# Altium schematic sheet FPGA - XC6SLX45T-2CSG324C.schdoc
size D
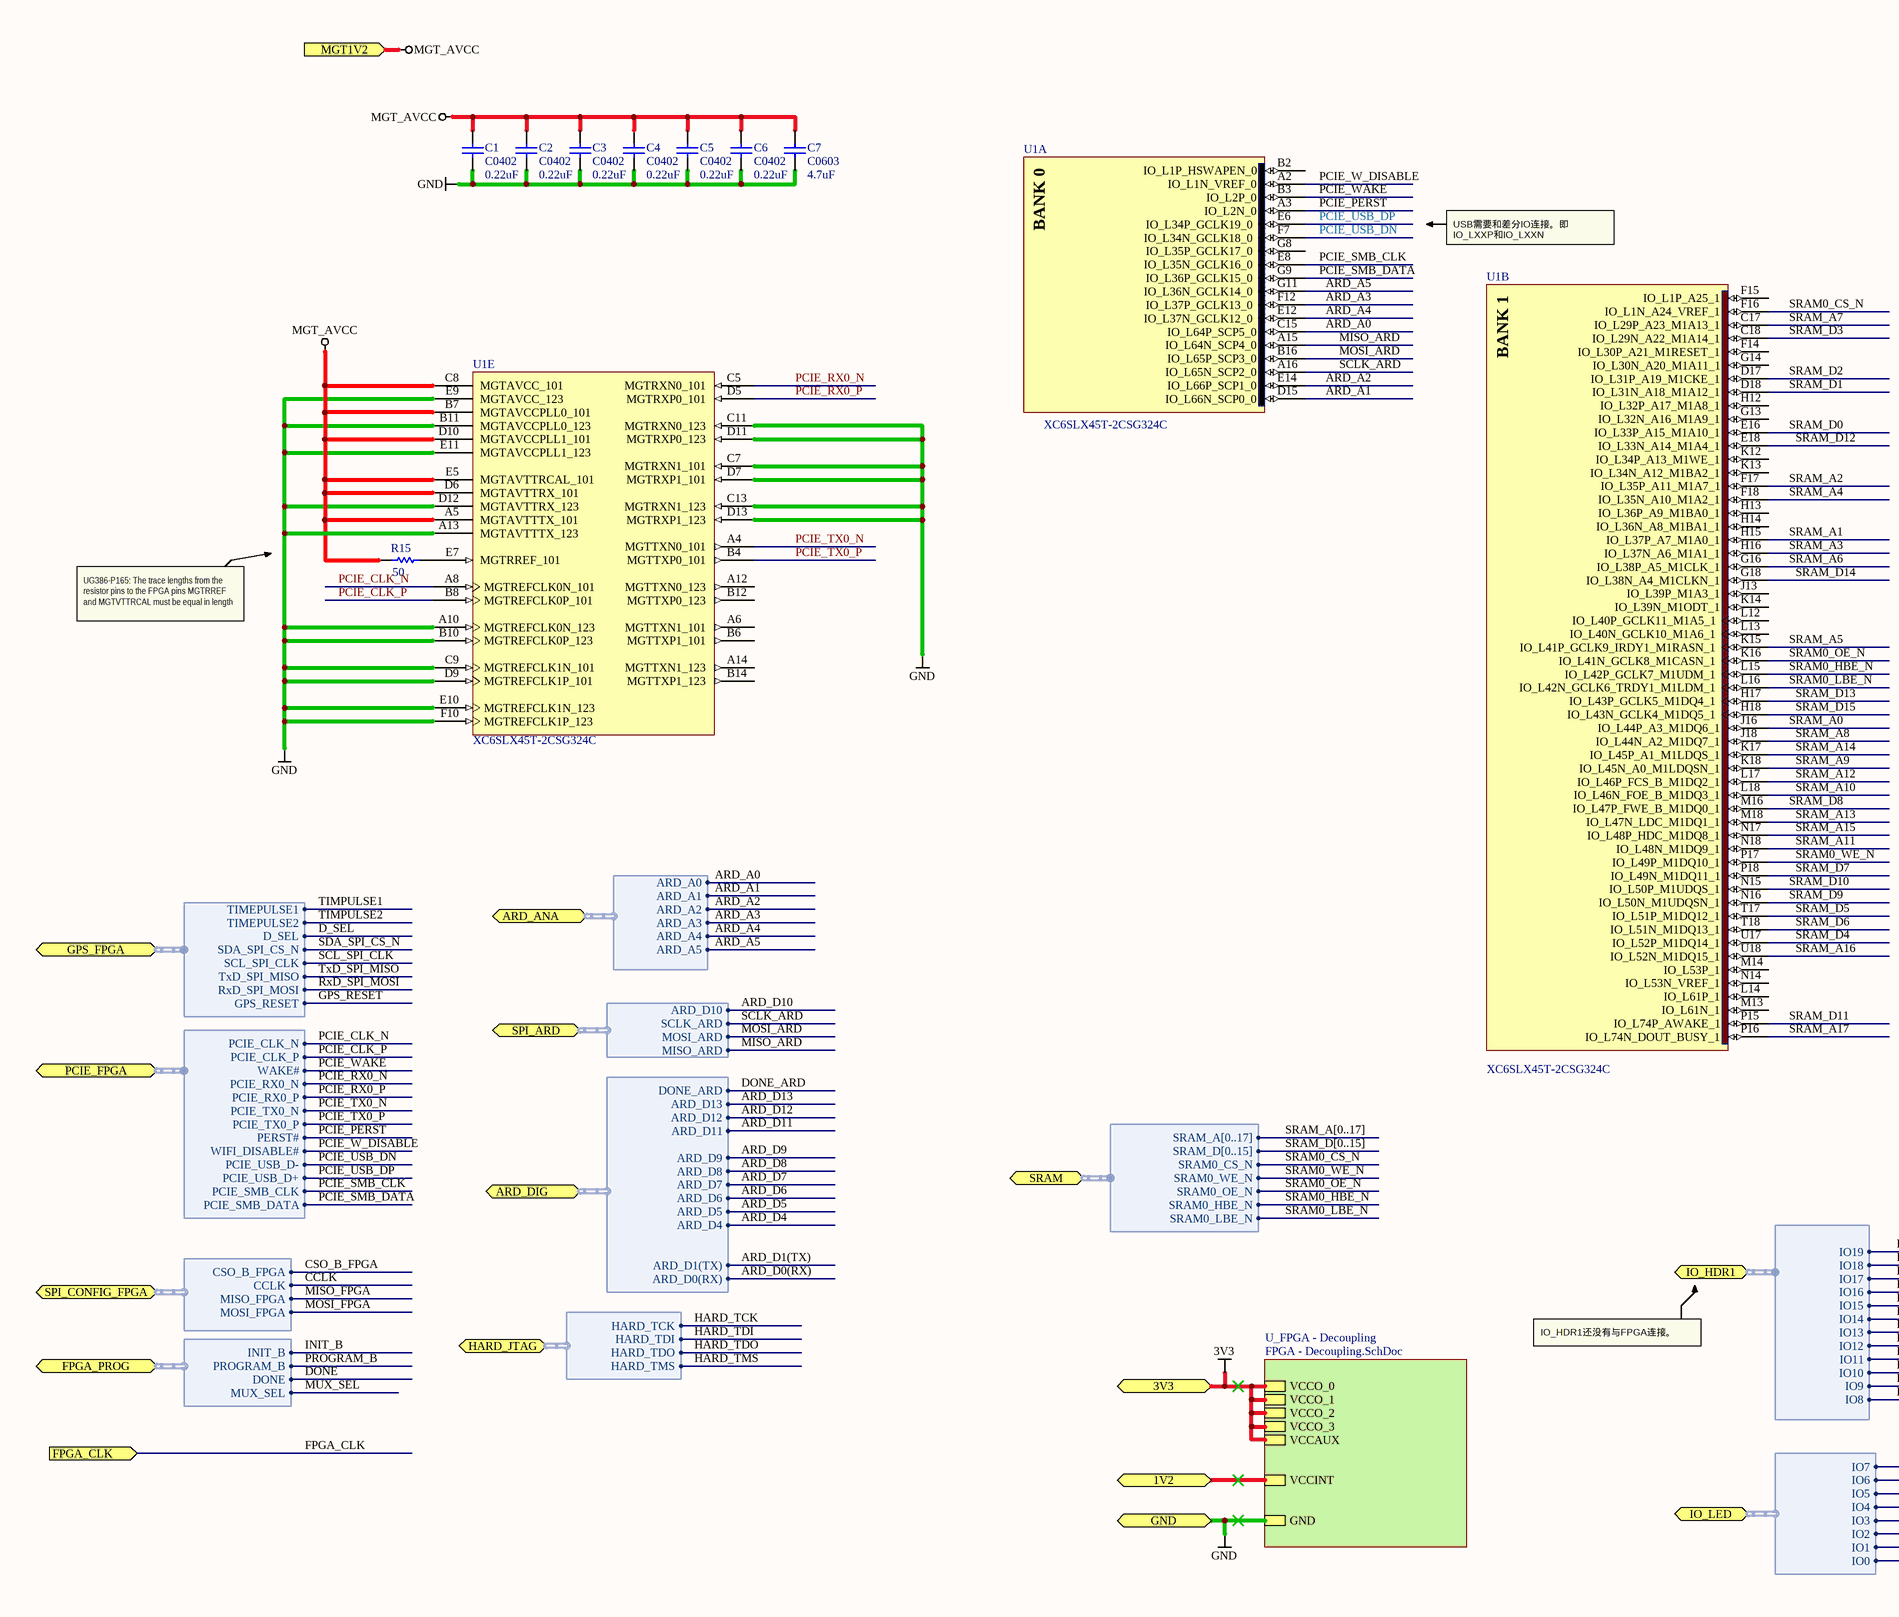
[diagram p0: FPGA - XC6SLX45T-2CSG324C.schdoc, left]
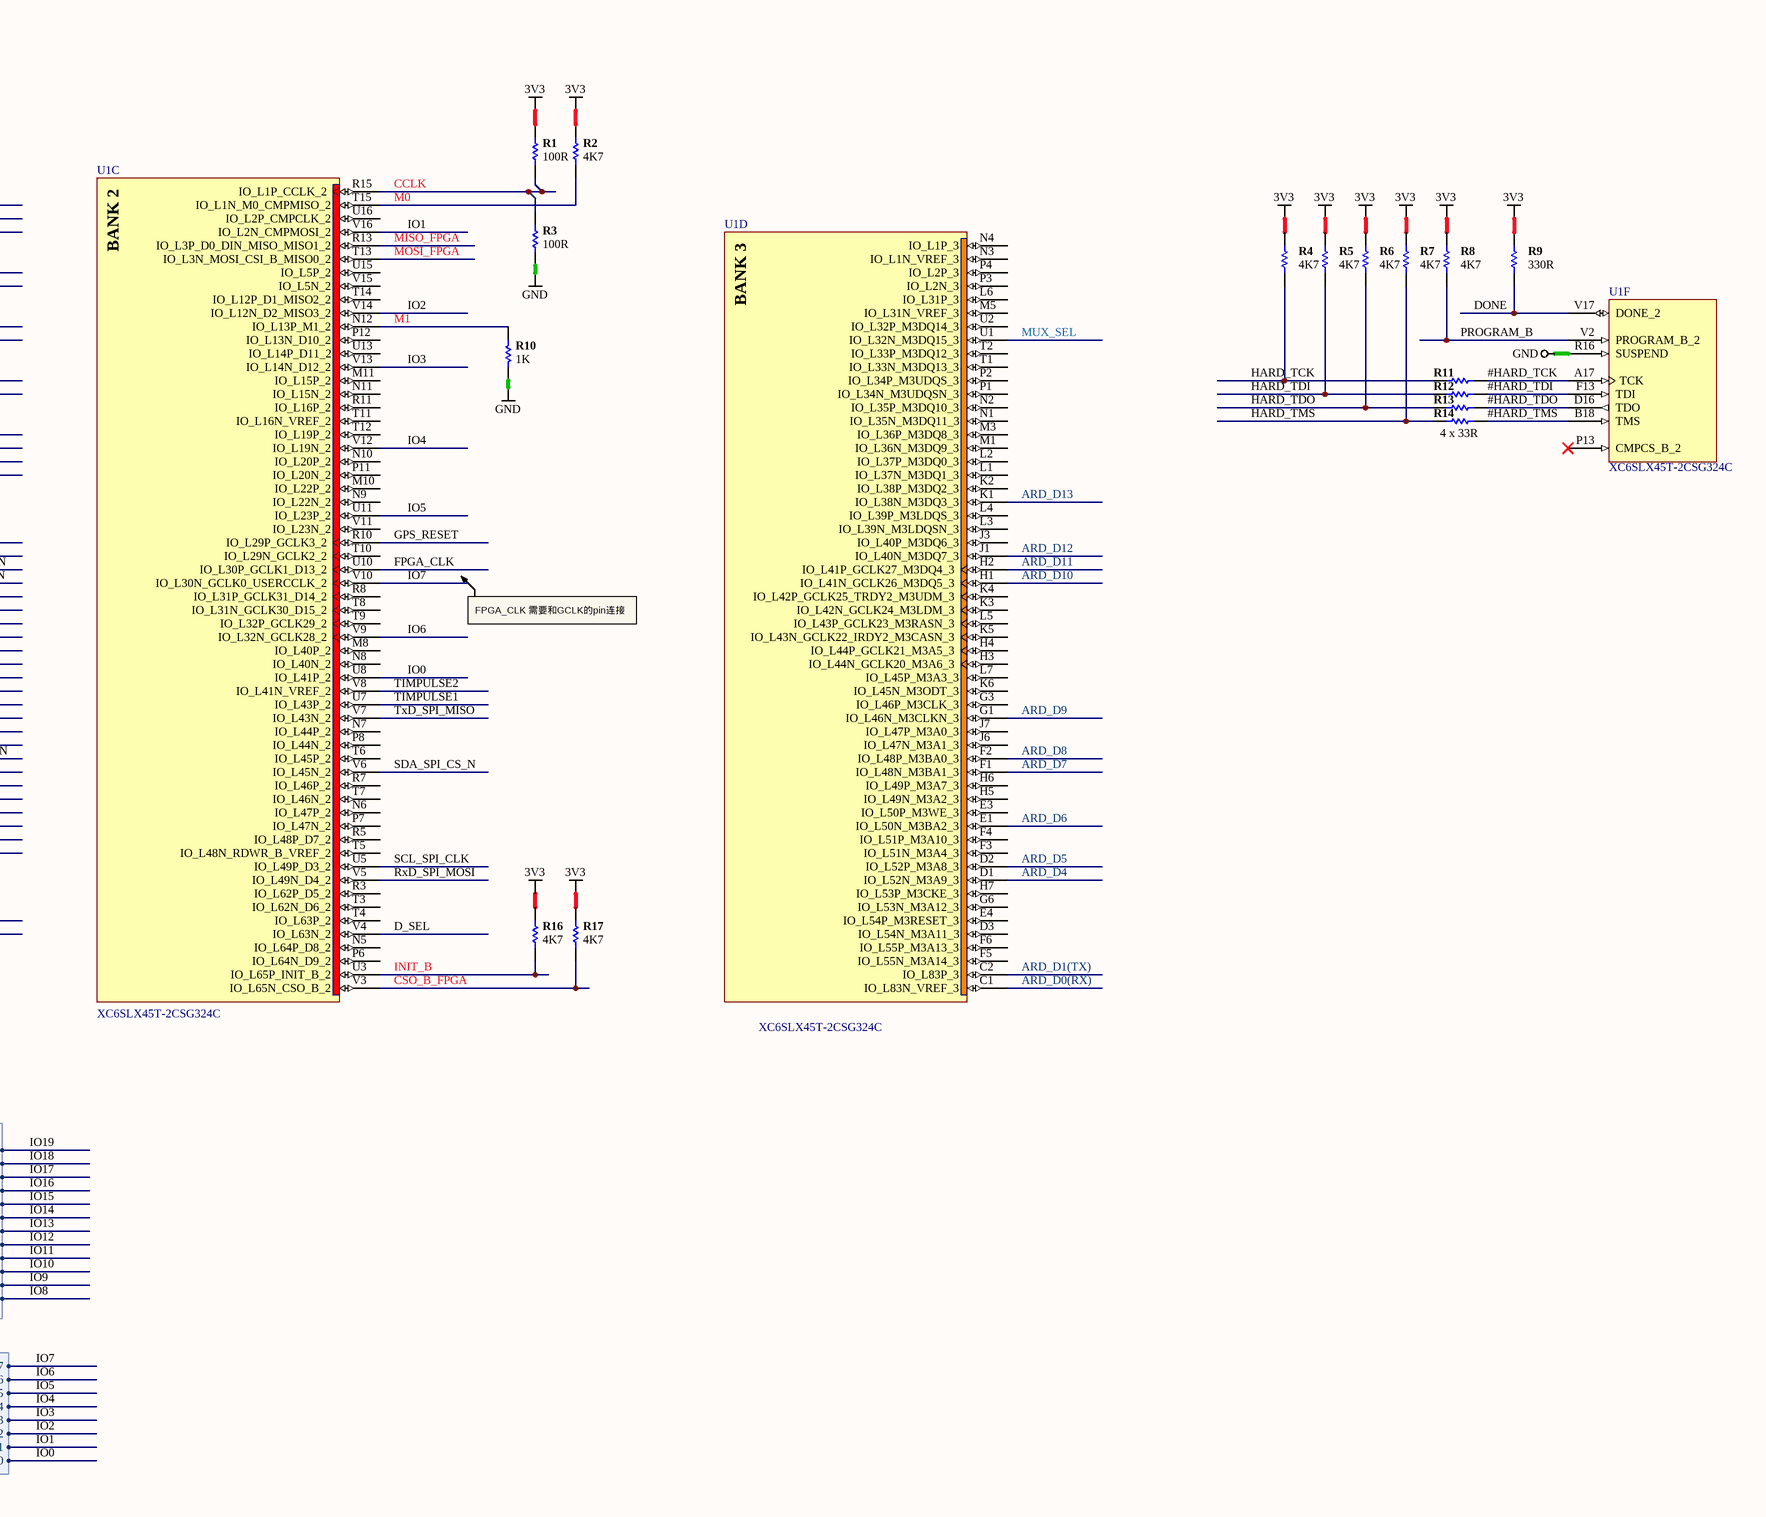
[diagram p1: FPGA - XC6SLX45T-2CSG324C.schdoc, right]

## Parts
C1  C0402  value 0.22uF  [CAPC0402(1005)60_L]
C2  C0402  value 0.22uF  [CAPC0402(1005)60_L]
C3  C0402  value 0.22uF  [CAPC0402(1005)60_L]
C4  C0402  value 0.22uF  [CAPC0402(1005)60_L]
C5  C0402  value 0.22uF  [CAPC0402(1005)60_L]
C6  C0402  value 0.22uF  [CAPC0402(1005)60_L]
C7  C0603  value 4.7uF  [CAPC0603(1608)55_L]
R1  value 100R  [RESC0402(1005)40_L]  (hidden comment: 100R 1 0402)
R2  value 4K7  [RESC0402(1005)40_L]  (hidden comment: 4K7 1 0402)
R3  value 100R  [RESC0402(1005)40_L]  (hidden comment: 100R 1 0402)
R4  value 4K7  [RESC0402(1005)40_L]  (hidden comment: 4K7 1 0402)
R5  value 4K7  [RESC0402(1005)40_L]  (hidden comment: 4K7 1 0402)
R6  value 4K7  [RESC0402(1005)40_L]  (hidden comment: 4K7 1 0402)
R7  value 4K7  [RESC0402(1005)40_L]  (hidden comment: 4K7 1 0402)
R8  value 4K7  [RESC0402(1005)40_L]  (hidden comment: 4K7 1 0402)
R9  value 330R  [RESC0402(1005)40_L]  (hidden comment: 330R 1 0402)
R10  value 1K  [RESC0402(1005)40_L]  (hidden comment: 1K 1 0402)
R11  33R 1 0402  [RESC0402(1005)40_L]  (value not drawn)
R12  33R 1 0402  [RESC0402(1005)40_L]  (value not drawn)
R13  33R 1 0402  [RESC0402(1005)40_L]  (value not drawn)
R14  33R 1 0402  [RESC0402(1005)40_L]  (value not drawn)
R15  value 50  [RESC0402(1005)40_L]  (hidden comment: Res1)
R16  value 4K7  [RESC0402(1005)40_L]  (hidden comment: 4K7 1 0402)
R17  value 4K7  [RESC0402(1005)40_L]  (hidden comment: 4K7 1 0402)
U1  XC6SLX45T-2CSG324C  [CSG324]  (parts A,B,C,D,E,F of 8)

## Sub-sheets
U_FPGA - Decoupling = FPGA - Decoupling.SchDoc: VCCO_0, VCCO_3, VCCO_1, VCCO_2, VCCAUX, VCCINT, GND

## Ports
1V2, 3V3, ARD_ANA (harness ARD_ANA), ARD_DIG (harness ARD_DIG), FPGA_CLK (in), FPGA_PROG (harness FPGA_PROGRAM), GND, GPS_FPGA (harness GPS_FPGA), HARD_JTAG (harness HARD_JTAG), IO_HDR1 (harness IO_HDR1), IO_LED (harness IO_LED), MGT1V2 (in), PCIE_FPGA (harness PCIE_FPGA), SPI_ARD (harness SPI_ARD), SPI_CONFIG_FPGA (harness SPI_CONFIG_FPGA), SRAM (harness SRAM)

## Harnesses
SPI_CONFIG_FPGA: CSO_B_FPGA, CCLK, MISO_FPGA, MOSI_FPGA
HARD_JTAG: HARD_TCK, HARD_TDI, HARD_TDO, HARD_TMS
FPGA_PROGRAM: INIT_B, PROGRAM_B, DONE, MUX_SEL
SRAM: SRAM_A[0..17], SRAM_D[0..15], SRAM0_CS_N, SRAM0_WE_N, SRAM0_OE_N, SRAM0_HBE_N, SRAM0_LBE_N
SPI_ARD: MISO_ARD, MOSI_ARD, SCLK_ARD, ARD_D10
ARD_DIG: ARD_D0(RX), ARD_D1(TX), ARD_D4, ARD_D5, ARD_D6, ARD_D7, ARD_D8, ARD_D9, ARD_D11, ARD_D12, ARD_D13, DONE_ARD
ARD_ANA: ARD_A0, ARD_A1, ARD_A2, ARD_A3, ARD_A4, ARD_A5
GPS_FPGA: TIMEPULSE1, TIMEPULSE2, SDA_SPI_CS_N, SCL_SPI_CLK, TxD_SPI_MISO, RxD_SPI_MOSI, D_SEL, GPS_RESET
IO_LED: IO0, IO1, IO2, IO3, IO4, IO5, IO6, IO7
IO_HDR1: IO12, IO13, IO16, IO17, IO18, IO19, IO14, IO15, IO8, IO9, IO10, IO11
PCIE_FPGA: PCIE_CLK_N, PCIE_CLK_P, PCIE_RX0_N, PCIE_RX0_P, PCIE_TX0_N, PCIE_TX0_P, PERST#, WIFI_DISABLE#, PCIE_USB_D-, PCIE_USB_D+, PCIE_SMB_CLK, PCIE_SMB_DATA, WAKE#

## Nets
3V3: R1.2 R2.2 R4.2 R5.2 R6.2 R7.2 R8.2 R9.2 R16.2 R17.2 ; port 3V3, sheet U_FPGA - Decoupling/VCCO_0, sheet U_FPGA - Decoupling/VCCO_3, sheet U_FPGA - Decoupling/VCCO_1, sheet U_FPGA - Decoupling/VCCO_2, sheet U_FPGA - Decoupling/VCCAUX
GND: C1.1 C2.1 C3.1 C4.1 C5.1 C6.1 C7.1 R3.1 R10.1 U1.A10(MGTREFCLK0N_123) U1.A13(MGTAVTTTX_123) U1.B10(MGTREFCLK0P_123) U1.B11(MGTAVCCPLL0_123) U1.C7(MGTRXN1_101) U1.C9(MGTREFCLK1N_101) U1.C11(MGTRXN0_123) U1.C13(MGTRXN1_123) U1.D7(MGTRXP1_101) U1.D9(MGTREFCLK1P_101) U1.D11(MGTRXP0_123) U1.D12(MGTAVTTRX_123) U1.D13(MGTRXP1_123) U1.E9(MGTAVCC_123) U1.E10(MGTREFCLK1N_123) U1.E11(MGTAVCCPLL1_123) U1.F10(MGTREFCLK1P_123) U1.R16(SUSPEND) ; port GND, sheet U_FPGA - Decoupling/GND
MGT_AVCC: C1.2 C2.2 C3.2 C4.2 C5.2 C6.2 C7.2 R15.1 U1.A5(MGTAVTTTX_101) U1.B7(MGTAVCCPLL0_101) U1.C8(MGTAVCC_101) U1.D6(MGTAVTTRX_101) U1.D10(MGTAVCCPLL1_101) U1.E5(MGTAVTTRCAL_101) ; port MGT1V2
1V2: port 1V2, sheet U_FPGA - Decoupling/VCCINT
#HARD_TCK: R11.2 U1.A17(TCK)
#HARD_TDI: R12.2 U1.F13(TDI)
#HARD_TDO: R13.2 U1.D16(TDO)
#HARD_TMS: R14.2 U1.B18(TMS)
ARD_A0: U1.C15(IO_L64P_SCP5_0) ; port ARD_ANA.ARD_A0
ARD_A1: U1.D15(IO_L66N_SCP0_0) ; port ARD_ANA.ARD_A1
ARD_A2: U1.E14(IO_L66P_SCP1_0) ; port ARD_ANA.ARD_A2
ARD_A3: U1.F12(IO_L37P_GCLK13_0) ; port ARD_ANA.ARD_A3
ARD_A4: U1.E12(IO_L37N_GCLK12_0) ; port ARD_ANA.ARD_A4
ARD_A5: U1.G11(IO_L36N_GCLK14_0) ; port ARD_ANA.ARD_A5
ARD_D0(RX): U1.C1(IO_L83N_VREF_3) ; port ARD_DIG.ARD_D0(RX)
ARD_D1(TX): U1.C2(IO_L83P_3) ; port ARD_DIG.ARD_D1(TX)
ARD_D4: U1.D1(IO_L52N_M3A9_3) ; port ARD_DIG.ARD_D4
ARD_D5: U1.D2(IO_L52P_M3A8_3) ; port ARD_DIG.ARD_D5
ARD_D6: U1.E1(IO_L50N_M3BA2_3) ; port ARD_DIG.ARD_D6
ARD_D7: U1.F1(IO_L48N_M3BA1_3) ; port ARD_DIG.ARD_D7
ARD_D8: U1.F2(IO_L48P_M3BA0_3) ; port ARD_DIG.ARD_D8
ARD_D9: U1.G1(IO_L46N_M3CLKN_3) ; port ARD_DIG.ARD_D9
ARD_D10: U1.H1(IO_L41N_GCLK26_M3DQ5_3) ; port SPI_ARD.ARD_D10
ARD_D11: U1.H2(IO_L41P_GCLK27_M3DQ4_3) ; port ARD_DIG.ARD_D11
ARD_D12: U1.J1(IO_L40N_M3DQ7_3) ; port ARD_DIG.ARD_D12
ARD_D13: U1.K1(IO_L38N_M3DQ3_3) ; port ARD_DIG.ARD_D13
CCLK: R1.1 R3.2 U1.R15(IO_L1P_CCLK_2) ; port SPI_CONFIG_FPGA.CCLK
CSO_B_FPGA: R17.1 U1.V3(IO_L65N_CSO_B_2) ; port SPI_CONFIG_FPGA.CSO_B_FPGA
D_SEL: U1.V4(IO_L63N_2) ; port GPS_FPGA.D_SEL
DONE: R9.1 U1.V17(DONE_2) ; port FPGA_PROG.DONE
DONE_ARD: port ARD_DIG.DONE_ARD
FPGA_CLK: U1.U10(IO_L30P_GCLK1_D13_2) ; port FPGA_CLK
GPS_RESET: U1.R10(IO_L29P_GCLK3_2) ; port GPS_FPGA.GPS_RESET
HARD_TCK: R4.1 R11.1 ; port HARD_JTAG.HARD_TCK
HARD_TDI: R5.1 R12.1 ; port HARD_JTAG.HARD_TDI
HARD_TDO: R6.1 R13.1 ; port HARD_JTAG.HARD_TDO
HARD_TMS: R7.1 R14.1 ; port HARD_JTAG.HARD_TMS
INIT_B: R16.1 U1.U3(IO_L65P_INIT_B_2) ; port FPGA_PROG.INIT_B
IO0: U1.U8(IO_L41P_2) ; port IO_LED.IO0
IO1: U1.V16(IO_L2N_CMPMOSI_2) ; port IO_LED.IO1
IO2: U1.V14(IO_L12N_D2_MISO3_2) ; port IO_LED.IO2
IO3: U1.V13(IO_L14N_D12_2) ; port IO_LED.IO3
IO4: U1.V12(IO_L19N_2) ; port IO_LED.IO4
IO5: U1.U11(IO_L23P_2) ; port IO_LED.IO5
IO6: U1.V9(IO_L32N_GCLK28_2) ; port IO_LED.IO6
IO7: U1.V10(IO_L30N_GCLK0_USERCCLK_2) ; port IO_LED.IO7
IO8: port IO_HDR1.IO8
IO9: port IO_HDR1.IO9
IO10: port IO_HDR1.IO10
IO11: port IO_HDR1.IO11
IO12: port IO_HDR1.IO12
IO13: port IO_HDR1.IO13
IO14: port IO_HDR1.IO14
IO15: port IO_HDR1.IO15
IO16: port IO_HDR1.IO16
IO17: port IO_HDR1.IO17
IO18: port IO_HDR1.IO18
IO19: port IO_HDR1.IO19
M0: R2.1 U1.T15(IO_L1N_M0_CMPMISO_2)
M1: R10.2 U1.N12(IO_L13P_M1_2)
MISO_ARD: U1.A15(IO_L64N_SCP4_0) ; port SPI_ARD.MISO_ARD
MISO_FPGA: U1.R13(IO_L3P_D0_DIN_MISO_MISO1_2) ; port SPI_CONFIG_FPGA.MISO_FPGA
MOSI_ARD: U1.B16(IO_L65P_SCP3_0) ; port SPI_ARD.MOSI_ARD
MOSI_FPGA: U1.T13(IO_L3N_MOSI_CSI_B_MISO0_2) ; port SPI_CONFIG_FPGA.MOSI_FPGA
MUX_SEL: U1.U1(IO_L32N_M3DQ15_3) ; port FPGA_PROG.MUX_SEL
PCIE_CLK_N: U1.A8(MGTREFCLK0N_101) ; port PCIE_FPGA.PCIE_CLK_N
PCIE_CLK_P: U1.B8(MGTREFCLK0P_101) ; port PCIE_FPGA.PCIE_CLK_P
PCIE_PERST: U1.A3(IO_L2N_0) ; port PCIE_FPGA.PERST#
PCIE_RX0_N: U1.C5(MGTRXN0_101) ; port PCIE_FPGA.PCIE_RX0_N
PCIE_RX0_P: U1.D5(MGTRXP0_101) ; port PCIE_FPGA.PCIE_RX0_P
PCIE_SMB_CLK: U1.E8(IO_L35N_GCLK16_0) ; port PCIE_FPGA.PCIE_SMB_CLK
PCIE_SMB_DATA: U1.G9(IO_L36P_GCLK15_0) ; port PCIE_FPGA.PCIE_SMB_DATA
PCIE_TX0_N: U1.A4(MGTTXN0_101) ; port PCIE_FPGA.PCIE_TX0_N
PCIE_TX0_P: U1.B4(MGTTXP0_101) ; port PCIE_FPGA.PCIE_TX0_P
PCIE_USB_DN: U1.F7(IO_L34N_GCLK18_0) ; port PCIE_FPGA.PCIE_USB_D-
PCIE_USB_DP: U1.E6(IO_L34P_GCLK19_0) ; port PCIE_FPGA.PCIE_USB_D+
PCIE_W_DISABLE: U1.A2(IO_L1N_VREF_0) ; port PCIE_FPGA.WIFI_DISABLE#
PCIE_WAKE: U1.B3(IO_L2P_0) ; port PCIE_FPGA.WAKE#
PROGRAM_B: R8.1 U1.V2(PROGRAM_B_2) ; port FPGA_PROG.PROGRAM_B
RxD_SPI_MOSI: U1.V5(IO_L49N_D4_2) ; port GPS_FPGA.RxD_SPI_MOSI
SCL_SPI_CLK: U1.U5(IO_L49P_D3_2) ; port GPS_FPGA.SCL_SPI_CLK
SCLK_ARD: U1.A16(IO_L65N_SCP2_0) ; port SPI_ARD.SCLK_ARD
SDA_SPI_CS_N: U1.V6(IO_L45N_2) ; port GPS_FPGA.SDA_SPI_CS_N
SRAM0_CS_N: U1.F16(IO_L1N_A24_VREF_1) ; port SRAM.SRAM0_CS_N
SRAM0_HBE_N: U1.L15(IO_L42P_GCLK7_M1UDM_1) ; port SRAM.SRAM0_HBE_N
SRAM0_LBE_N: U1.L16(IO_L42N_GCLK6_TRDY1_M1LDM_1) ; port SRAM.SRAM0_LBE_N
SRAM0_OE_N: U1.K16(IO_L41N_GCLK8_M1CASN_1) ; port SRAM.SRAM0_OE_N
SRAM0_WE_N: U1.P17(IO_L49P_M1DQ10_1) ; port SRAM.SRAM0_WE_N
SRAM_A0: U1.J16(IO_L44P_A3_M1DQ6_1)
SRAM_A1: U1.H15(IO_L37P_A7_M1A0_1)
SRAM_A2: U1.F17(IO_L35P_A11_M1A7_1)
SRAM_A3: U1.H16(IO_L37N_A6_M1A1_1)
SRAM_A4: U1.F18(IO_L35N_A10_M1A2_1)
SRAM_A5: U1.K15(IO_L41P_GCLK9_IRDY1_M1RASN_1)
SRAM_A6: U1.G16(IO_L38P_A5_M1CLK_1)
SRAM_A7: U1.C17(IO_L29P_A23_M1A13_1)
SRAM_A8: U1.J18(IO_L44N_A2_M1DQ7_1)
SRAM_A9: U1.K18(IO_L45N_A0_M1LDQSN_1)
SRAM_A10: U1.L18(IO_L46N_FOE_B_M1DQ3_1)
SRAM_A11: U1.N18(IO_L48N_M1DQ9_1)
SRAM_A12: U1.L17(IO_L46P_FCS_B_M1DQ2_1)
SRAM_A13: U1.M18(IO_L47N_LDC_M1DQ1_1)
SRAM_A14: U1.K17(IO_L45P_A1_M1LDQS_1)
SRAM_A15: U1.N17(IO_L48P_HDC_M1DQ8_1)
SRAM_A16: U1.U18(IO_L52N_M1DQ15_1)
SRAM_A17: U1.P16(IO_L74N_DOUT_BUSY_1)
SRAM_D0: U1.E16(IO_L33P_A15_M1A10_1)
SRAM_D1: U1.D18(IO_L31N_A18_M1A12_1)
SRAM_D2: U1.D17(IO_L31P_A19_M1CKE_1)
SRAM_D3: U1.C18(IO_L29N_A22_M1A14_1)
SRAM_D4: U1.U17(IO_L52P_M1DQ14_1)
SRAM_D5: U1.T17(IO_L51P_M1DQ12_1)
SRAM_D6: U1.T18(IO_L51N_M1DQ13_1)
SRAM_D7: U1.P18(IO_L49N_M1DQ11_1)
SRAM_D8: U1.M16(IO_L47P_FWE_B_M1DQ0_1)
SRAM_D9: U1.N16(IO_L50N_M1UDQSN_1)
SRAM_D10: U1.N15(IO_L50P_M1UDQS_1)
SRAM_D11: U1.P15(IO_L74P_AWAKE_1)
SRAM_D12: U1.E18(IO_L33N_A14_M1A4_1)
SRAM_D13: U1.H17(IO_L43P_GCLK5_M1DQ4_1)
SRAM_D14: U1.G18(IO_L38N_A4_M1CLKN_1)
SRAM_D15: U1.H18(IO_L43N_GCLK4_M1DQ5_1)
TIMPULSE1: U1.U7(IO_L43P_2) ; port GPS_FPGA.TIMEPULSE1
TIMPULSE2: U1.V8(IO_L41N_VREF_2) ; port GPS_FPGA.TIMEPULSE2
TxD_SPI_MISO: U1.V7(IO_L43N_2) ; port GPS_FPGA.TxD_SPI_MISO
NetR15_2: R15.2 U1.E7(MGTRREF_101)

Not connected (* = marked no-connect by the designer): U1 A6(MGTTXN1_101) A12(MGTTXN0_123) A14(MGTTXN1_123) B2(IO_L1P_HSWAPEN_0) B6(MGTTXP1_101) B12(MGTTXP0_123) B14(MGTTXP1_123) D3(IO_L54N_M3A11_3) E3(IO_L50P_M3WE_3) E4(IO_L54P_M3RESET_3) F3(IO_L51N_M3A4_3) F4(IO_L51P_M3A10_3) F5(IO_L55N_M3A14_3) F6(IO_L55P_M3A13_3) F14(IO_L30P_A21_M1RESET_1) F15(IO_L1P_A25_1) G3(IO_L46P_M3CLK_3) G6(IO_L53N_M3A12_3) G8(IO_L35P_GCLK17_0) G13(IO_L32N_A16_M1A9_1) G14(IO_L30N_A20_M1A11_1) H3(IO_L44N_GCLK20_M3A6_3) H4(IO_L44P_GCLK21_M3A5_3) H5(IO_L49N_M3A2_3) H6(IO_L49P_M3A7_3) H7(IO_L53P_M3CKE_3) H12(IO_L32P_A17_M1A8_1) H13(IO_L36P_A9_M1BA0_1) H14(IO_L36N_A8_M1BA1_1) J3(IO_L40P_M3DQ6_3) J6(IO_L47N_M3A1_3) J7(IO_L47P_M3A0_3) J13(IO_L39P_M1A3_1) K2(IO_L38P_M3DQ2_3) K3(IO_L42N_GCLK24_M3LDM_3) K4(IO_L42P_GCLK25_TRDY2_M3UDM_3) K5(IO_L43N_GCLK22_IRDY2_M3CASN_3) K6(IO_L45N_M3ODT_3) K12(IO_L34P_A13_M1WE_1) K13(IO_L34N_A12_M1BA2_1) K14(IO_L39N_M1ODT_1) L1(IO_L37N_M3DQ1_3) L2(IO_L37P_M3DQ0_3) L3(IO_L39N_M3LDQSN_3) L4(IO_L39P_M3LDQS_3) L5(IO_L43P_GCLK23_M3RASN_3) L6(IO_L31P_3) L7(IO_L45P_M3A3_3) L12(IO_L40P_GCLK11_M1A5_1) L13(IO_L40N_GCLK10_M1A6_1) L14(IO_L61P_1) M1(IO_L36N_M3DQ9_3) M3(IO_L36P_M3DQ8_3) M5(IO_L31N_VREF_3) M8(IO_L40P_2) M10(IO_L22P_2) M11(IO_L15P_2) M13(IO_L61N_1) M14(IO_L53P_1) N1(IO_L35N_M3DQ11_3) N2(IO_L35P_M3DQ10_3) N3(IO_L1N_VREF_3) N4(IO_L1P_3) N5(IO_L64P_D8_2) N6(IO_L47P_2) N7(IO_L44P_2) N8(IO_L40N_2) N9(IO_L22N_2) N10(IO_L20P_2) N11(IO_L15N_2) N14(IO_L53N_VREF_1) P1(IO_L34N_M3UDQSN_3) P2(IO_L34P_M3UDQS_3) P3(IO_L2N_3) P4(IO_L2P_3) P6(IO_L64N_D9_2) P7(IO_L47N_2) P8(IO_L44N_2) P11(IO_L20N_2) P12(IO_L13N_D10_2) P13(CMPCS_B_2)* R3(IO_L62P_D5_2) R5(IO_L48P_D7_2) R7(IO_L46P_2) R8(IO_L31P_GCLK31_D14_2) R11(IO_L16P_2) T1(IO_L33N_M3DQ13_3) T2(IO_L33P_M3DQ12_3) T3(IO_L62N_D6_2) T4(IO_L63P_2) T5(IO_L48N_RDWR_B_VREF_2) T6(IO_L45P_2) T7(IO_L46N_2) T8(IO_L31N_GCLK30_D15_2) T9(IO_L32P_GCLK29_2) T10(IO_L29N_GCLK2_2) T11(IO_L16N_VREF_2) T12(IO_L19P_2) T14(IO_L12P_D1_MISO2_2) U2(IO_L32P_M3DQ14_3) U13(IO_L14P_D11_2) U15(IO_L5P_2) U16(IO_L2P_CMPCLK_2) V11(IO_L23N_2) V15(IO_L5N_2)

## Buses and harness runs
bus SRAM_A[0..17]
bus SRAM_D[0..15]

## Notes on the sheet
- USB需要和差分IO连接。即IO_LXXP和IO_LXXN
- (near R14) 4 x 33R
- UG386-P165: The trace lengths from the resistor pins to the FPGA pins MGTRREF and MGTVTTRCAL must be equal in length
- FPGA_CLK 需要和GCLK的pin连接
- IO_HDR1还没有与FPGA连接。
- (in symbol XC6SLX45T-2CSG324C, part A) BANK 0
- (in symbol XC6SLX45T-2CSG324C, part B) BANK 1
- (in symbol XC6SLX45T-2CSG324C, part C) BANK 2
- (in symbol XC6SLX45T-2CSG324C, part D) BANK 3

## Library data of the parts
C1-C6 = C0402: Ceramic Chip Capacitor - Standard; Note: Footprint corresponds to dimensions for bulk cassette packaging. This case size has tightened tolerances.; Published: 17-Jul-2002; LatestRevisionDate: 19-Mar-2004; LatestRevisionNote: Silkscreen size reduced.; DatasheetDocument: Mar-2001; PackageDocument: Mar-2001; PackageReference: 0402; Publisher: Altium Limited; Code_JEITA: 0402; Code_IPC: 1005 [0402]; ComponentLink1Description: Manufacturer Link; ComponentLink1URL: http://www.kemet.com/; ComponentLink2Description: Datasheet; ComponentLink2URL: http://www.kemet.com/kemet/web/homepage/kechome.nsf/vapubfilesname/F3102TA.pdf/$file/F3102TA.pdf
C7 = C0603: Ceramic Chip Capacitor - Standard; Note: Footprint corresponds to dimensions for bulk cassette packaging. This case size has tightened tolerances.; Published: 17-Jul-2002; LatestRevisionDate: 19-Mar-2004; LatestRevisionNote: Silkscreen size reduced.; DatasheetDocument: Mar-2001; PackageDocument: Mar-2001; PackageReference: 0603; Publisher: Altium Limited; Code_JEITA: 0603; Code_IPC: 1608 [0603]; ComponentLink1Description: Manufacturer Link; ComponentLink1URL: http://www.kemet.com/; ComponentLink2Description: Datasheet; ComponentLink2URL: http://www.kemet.com/kemet/web/homepage/kechome.nsf/vapubfilesname/F3102TA.pdf/$file/F3102TA.pdf
R1 R3 = 0402 (1005 Metric) 1/16 W 100R 1 Thick Film Chip Resistor: Manufacturer_PN: CR0603-FX-1000ELFDKR-ND; Power: 1/16 W; Case-Metric: 1005; Case-EIA: 0402; Temp Coefficient ppm/°C: ±100; Tolerance %: 1%; Value (Ohms): 100; Technology: SMT; Manufacturer Part Number: CR0603-FX-1000ELFDKR-ND
R2 R4-R8 R16 R17 = 0402 (1005 Metric) 1/16 W 4K7 1 Thick Film Chip Resistor: Manufacturer_PN: CR0402-FX-4701GLFDKR-ND; Case-EIA: 0402; Case-Metric: 1005; Power: 1/16 W; Temp Coefficient ppm/°C: ±100; Tolerance %: 1%; Value (Ohms): 4700; Technology: SMT; Manufacturer Part Number: CR0402-FX-4701GLFDKR-ND
R9 = 0402 (1005 Metric) 1/16 W 330R 1 Thick Film Chip Resistor: Manufacturer_PN: RC1005F331CS; Case-EIA: 0402; Case-Metric: 1005; Power: 1/16 W; Temp Coefficient ppm/°C: ±100; Tolerance %: 1%; Value (Ohms): 330; Technology: SMT; Manufacturer Part Number: RC1005F331CS
R10 = 0402 (1005 Metric) 1/16 W 1K 1 Thick Film Chip Resistor: Manufacturer_PN: CR0402-FX-1001GLFDKR-ND; Power: 1/16 W; Case-Metric: 1005; Case-EIA: 0402; Temp Coefficient ppm/°C: ±100; Tolerance %: 1%; Value (Ohms): 1000; Technology: SMT; Manufacturer Part Number: CR0402-FX-1001GLFDKR-ND
R11-R14 = 0402 (1005 Metric) 1/16 W 33R 1 Thick Film Chip Resistor: Manufacturer_PN: RC1005F330CS; Power: 1/16 W; Case-EIA: 0402; Case-Metric: 1005; Temp Coefficient ppm/°C: ±100; Tolerance %: 1%; Value (Ohms): 33; Technology: SMT; Value: 33R; Manufacturer Part Number: RC1005F330CS
R15 = Res1: Resistor; Published: 8-Jun-2000; LatestRevisionDate: 17-Jul-2002; LatestRevisionNote: Re-released for DXP Platform.; PackageReference: AXIAL-0.3; Publisher: Altium Limited; PackageDescription: Axial Device, Thru-Hole; 2 Leads; 0.3 in Pin Spacing
U1 = XC6SLX45T-2CSG324C: Spartan-6 LXT 1.2V FPGA, 190 User I/Os, 324-Ball Chip-Scale BGA (0.8mm Pitch), Speed Grade 2, Commercial Grade, Pb-Free; Published: 17-Nov-2009; DatasheetVersion: ver1.6, Nov-2010; PackageVersion: ver1.1, Nov-2009; PackageReference: CSG324; Publisher: Altium Limited; PackageDescription: 324-Ball Chip-Scale BGA (CSG324) Package, 0.8 mm Pitch; Supplier 1: Digi-Key; Supplier Part Number 1: XC6SLX45T-2CSG324C-ND; Code_JEDEC: MO-275-KKAC-1; ComponentLink1Description: Manufacturer Link; ComponentLink1URL: http://www.xilinx.com; ComponentLink2Description: Spartan-6 Datasheet; ComponentLink2URL: http://www.xilinx.com/support/documentation/data_sheets/ds160.pdf; ComponentLink3Description: Spartan-6 Documents; ComponentLink3URL: http://www.xilinx.com/support/documentation/spartan-6.htm; ComponentLink4Description: Xilinx.com Home; ComponentLink4URL: http://www.xilinx.com